# Altium schematic sheet Sheet1.SchDoc
size 431 x 279 mm; SheetNumber: 1; SheetTotal: 1; ENG_APP_DATE: --/--/--; DSN_APP_DATE: --/--/--; CHK_APP_DATE: --/--/--
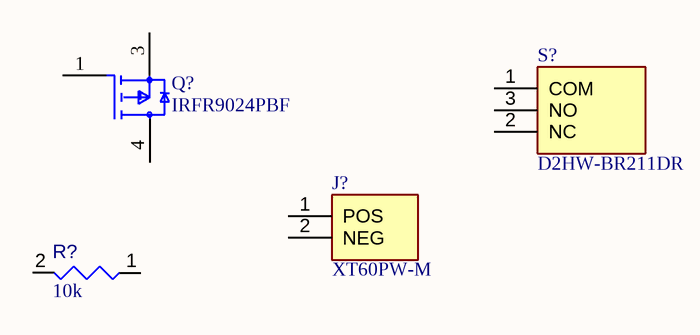
[diagram p0: Sheet1.SchDoc]

## Parts
J?  XT60PW-M  [AMASS_XT60PW-M]
Q?  IRFR9024PBF  [FP-E22-0399-N-MFG]
R?  value 10k  [RESC0402(1005)_L]  (hidden comment: Resistor 10K  +/-1 % 0402 63 mW)
S?  D2HW-BR211DR  [D2HWBR211DR]

## Nets

Not connected (* = marked no-connect by the designer): J? 1(POS) 2(NEG); Q? 1(G) 3(S) 4(D); R? 1 2; S? 1(COM) 2(NC) 3(NO)

## Notes on the sheet
- DWG. NO.
- REV.
- SHT.
- THIS DOCUMENT AND THE DATA DISCLOSED HEREIN OR HEREWITH IS THE PROPERTY OF ALTIUM LIMITED AND MAY BE FREELY DISTRIBUTED IN WHOLE. NO RIGHTS ARE RESERVED OR EXPRESS OR IMPLIED WARANTEE GIVEN.
- REVISION
- DESCRIPTION
- DATE
- APPROVED
- ENG:
- APPROVALS
- PROJECT
- DSN:
- CHK:
- REFERENCE DOCUMENTS
- PROJECT REVISION:
- TITLE
- DOCUMENT REVISION:
- DESIGN ITEM:
- BOM:
- FAB DWG:
- PCB DWG:
- ASSY DWG:
- SCALE:
- SIZE
- B
- CAGE CODE
- FILE NAME
- DWG NO.
- SHEET
- OF
- REV

## Library data of the parts
J? = CMP-025-000000-2: Design Item ID: XT60PW-M; Package: None; Availability: Unavailable; Pin Count: 2; MP: XT60PW-M; Price: None; Source: XT60PW-M.SchLib; Value: *; Component Type: Standard
Q? = CMP-02550-000303-1: MOSFET P-CH 60V 8.8A DPAK; Max Power Dissipation: 2.5W; Recovery Time: 200ns; Rise Time: 68ns; Element Configuration: Single; Drain to Source Breakdown Voltage: -60V; Current Rating: -8.8A; Polarity: P-CHANNEL; Drain-source On Resistance-Max: 280mR; Threshold Voltage: -4V; Polarization: P; Fall Time: 29ns; Turn-Off Delay Time: 15ns; Number of Elements: 1; Gate to Source Voltage (Vgs): 20V; Turn-On Delay Time: 13ns; Input Capacitance: 570pF; Package Quantity: 3000; Lead Free: Lead Free; RoHS Compliant: Yes; Case/Package: DPAK; Mount: Surface Mount; Radiation Hardening: No; Number of Pins: 3; Height: 2.39mm; Power Dissipation: 2.5W; Min Operating Temperature: -55°C; Width: 6.22mm; On-State Resistance: 280mR; Series: IRF/SIHFx9024; Weight: 0.050717oz; Max Operating Temperature: 150°C; Continuous Drain Current (ID): 8.8A; Voltage Rating (DC): -60V; Packaging: Rail/Tube; Length: 6.73mm; Rds On Max: 280mR; Drain to Source Resistance: 280mR; Drain to Source Voltage (Vdss): 60V; Number of Channels: 1
R? = CMP-009-00149-3: Chip Resistor, 10 kOhms, +/-1 %, 63 mW, -55 to 125 degC, 0402; Power: 63mW; Tolerance: 1%; Min Operating Temperature: -55°C; Case/Package: 0402; Max Operating Temperature: 155°C; Pins: 2
S? = D2HW-BR211DR: Switch; Manufacturer_Name: Omron Electronics; Datasheet Link: https://omronfs.omron.com/en_US/ecb/products/pdf/en-d2hw.pdf; Height: 5.3mm; Manufacturer_Part_Number: D2HW-BR211DR; Mouser Part Number: 653-D2HW-BR211DR; Mouser Price/Stock: https://www.mouser.com/Search/Refine.aspx?Keyword=653-D2HW-BR211DR